# Altium project FLYBACK 220-24V.PrjPcb
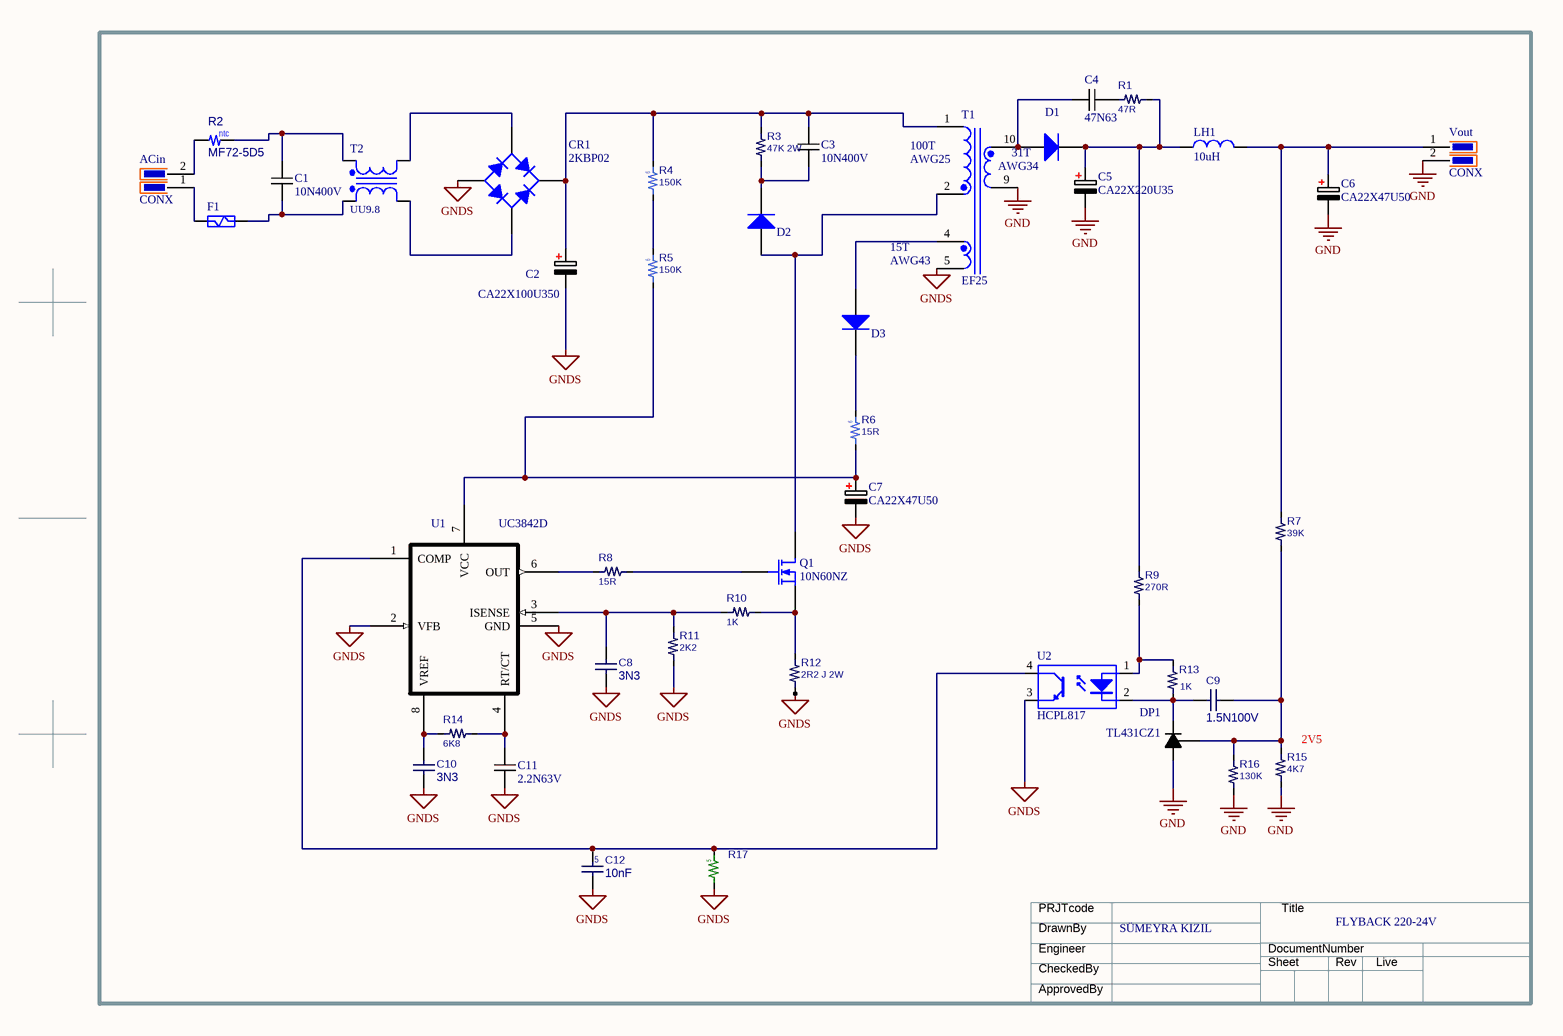
[diagram p0: FLYBACK 220-24V.SchDoc]
1 sheet, 43 parts. Net scope: global (net labels, ports and power ports of the same name join across sheets).
Board file: FLYBACK 220-24V.PcbDoc

## Sheet FLYBACK 220-24V.SchDoc
size A4; SheetNumber: 1; SheetTotal: 1

### Parts
ACin  CONX  [MBDK122]
C1  value 10N400V  [RAD0.3]  (hidden comment: CM03Y10N0V400)
C2  CA22X100U350  [24X30]
C3  value 10N400V  [RAD0.2]  (hidden comment: CM02Y10N0V400)
C4  value 47N63  [RAD0.2]  (hidden comment: CM02Y47N0V63)
C5  CA22X220U35  [8X12XP150]
C6  CA22X47U50  [8X12XP150]
C7  CA22X47U50  [6.3X11]
C8  value 3N3  [RAD0.2]  (hidden comment: CB02X3N30)
C9  value 1.5N100V  [RAD0.2]  (hidden comment: CB02X1N50)
C10  value 3N3  [RAD0.2]  (hidden comment: CB02X3N30)
C11  value 2.2N63V  [RAD0.2]  (hidden comment: CM02Y2N20V63)
C12  value 10nF  [RAD0.3]  (hidden comment: CHC0805-10N0)
CR1  2KBP02  [KBU]
D1  UF5402  [DO-41]  (value not drawn)
D2  UF4007  [DO-41]  (value not drawn)
D3  UF4007  [DO-41]  (value not drawn)
DP1  TL431CZ1  [TL431]
F1  (no value)  [Sigorta Tutucu]
LH1  10uH  [10X13L]
Q1  10N60NZ  [TO220]
R1  value 47R  [AXIAL0.4]  (hidden comment: RF24-47R0)
R2  MF72-5D5  [RAD0.3NTC]
R3  value 47K 2W  [AXIAL0.7]  (hidden comment: RF13-47K0)
R4  value 150K  [AXIAL0.4]  (hidden comment: CHR1206-15R0)
R5  value 150K  [AXIAL0.4]  (hidden comment: CHR1206-15R0)
R6  value 15R  [AXIAL0.5]  (hidden comment: CHR1206-15R0)
R7  value 39K  [AXIAL0.5]  (hidden comment: RF24-39K0)
R8  value 15R  [AXIAL0.4]  (hidden comment: RF24-15R0)
R9  value 270R  [AXIAL0.6]  (hidden comment: RF24-270R)
R10  value 1K  [AXIAL0.4]  (hidden comment: RF24-1K00)
R11  value 2K2  [AXIAL0.4]  (hidden comment: RF24-2K20)
R12  value 2R2 J 2W  [AXIAL0.7]  (hidden comment: RW02J-2R20)
R13  value 1K  [AXIAL0.4]  (hidden comment: RF24-1K00)
R14  value 6K8  [AXIAL0.4]  (hidden comment: RF24-6K80)
R15  value 4K7  [AXIAL0.4]  (hidden comment: RF24-4K70)
R16  value 130K  [AXIAL0.4]  (hidden comment: RF24-130K)
R17  CHR0805-10K0  [AXIAL0.4]  (value not drawn)
T1  EF25  [TRF_EF25_40]
T2  UU9.8  [LFILT11]
U1  UC3842D  [DIP8]
U2  HCPL817  [DIP4]
Vout  CONX  [MBDK122]

### Nets
GND: C5.2 C6.2 DP1.2(A) R15.1 R16.1 T1.9(Sec-) Vout.2
GNDS: C2.2 C7.2 C8.1 C10.1 C11.1 C12.1 CR1.4(A) R11.1 R12.1 R17.1 T1.5(FB-) U1.2(VFB) U1.5(GND) U2.3(E)
NetACin_1: ACin.1 F1.1
NetACin_2: ACin.2 R2.1
NetC1_1: C1.1 F1.2 T2.1
NetC1_2: C1.2 R2.2 T2.2
NetC2_1: C2.1 C3.2 CR1.1(K) R3.2 R4.2 T1.1(Pri+)
NetC3_1: C3.1 D2.2(K) R3.1
NetC4_1: C4.1 D1.1(A) T1.10(Sec+)
NetC4_2: C4.2 R1.1
NetC5_1: C5.1 D1.2(K) LH1.1 R1.2 R9.2
NetC6_1: C6.1 LH1.2 R7.2 Vout.1
NetC7_1: C7.1 R5.1 R6.1 U1.7(VCC)
NetC8_2: C8.2 R10.1 R11.2 U1.3(ISENSE)
NetC9_1: C9.1 DP1.1(K) R13.1 U2.2(K)
NetC9_2: C9.2 DP1.3(REF) R7.1 R15.2 R16.2
NetC10_2: C10.2 R14.1 U1.8(VREF)
NetC11_2: C11.2 R14.2 U1.4(RT/CT)
NetC12_2: C12.2 R17.2 U1.1(COMP) U2.4(C)
NetCR1_2: CR1.2(C) T2.4
NetCR1_3: CR1.3(C) T2.3
NetD2_1: D2.1(A) Q1.2(D) T1.2(Pri-)
NetD3_1: D3.1(A) T1.4(FB+)
NetD3_2: D3.2(K) R6.2
NetQ1_1: Q1.1(G) R8.2
NetQ1_3: Q1.3(S) R10.2 R12.2
NetR4_1: R4.1 R5.2
NetR8_1: R8.1 U1.6(OUT)
NetR9_1: R9.1 R13.2 U2.1(A)

### Notes on the sheet
- (near T1) 100T
- (near T1) AWG25
- (near T1) AWG34
- 31T
- 15T
- AWG43
- (near R15) 2V5
- FLYBACK 220-24V
- SÜMEYRA KIZIL
- PRJTcode
- Title
- DrawnBy
- CheckedBy
- Engineer
- DocumentNumber
- Sheet
- Rev
- Live
- ApprovedBy
- (in symbol CHC0805-10N0) 5
- (in symbol CHR0805-10K0) 5
- (in symbol CHR1206-15R0) 6
- (in symbol MF72-5D5) ntc

### Library data of the parts
ACin Vout = CON2X: X PIN CONN
C1 = CM03Y10N0V400: METALLISED POLYSTER CAP; Manufacturer: Generic Components; Class: Passive; Published: 08/06/2000; Publisher: NET; SubClass: METALLISED POLYSTER CAP
C2 = CA22X68U350: Electrolytic Capacitor general use; Manufacturer: Generic Components; Class: Passive; Value: 68U350; SubClass: Capacitor
C3 = CM02Y10N0V400: METALLISED POLYSTER CAP; Manufacturer: Generic Components; Class: Passive; Published: 08/06/2000; Publisher: NET; SubClass: METALLISED POLYSTER CAP
C4 = CM02Y47N0V63: METALLISED POLYSTER CAP; Manufacturer: Generic Components; Class: Passive; Published: 08/06/2000; Publisher: NET; SubClass: METALLISED POLYSTER CAP
C5 = CA22X220U35: Electrolytic Capacitor general use; Manufacturer: Generic Components; Class: Passive; Value: 220U35; SubClass: Capacitor
C6 C7 = CA22X47U50: Electrolytic Capacitor general use; Manufacturer: Generic Components; Class: Passive; Value: 47U50; SubClass: Capacitor
C8 C10 = CB02X3N30: CERAMIC DISC CAPACITOR; Manufacturer: Generic Components; Class: Passive; Published: 12/03/04; Publisher: Nettas Technology Center; SubClass: Capacitor
C9 = CB02X1N50: CERAMIC DISC CAPACITOR; Manufacturer: Generic Components; Class: Passive; Published: 12/03/04; Publisher: Nettas Technology Center; SubClass: Capacitor
C11 = CM02Y2N20V63: METALLISED POLYSTER CAP; Manufacturer: Generic Components; Class: Passive; Published: 08/06/2000; Publisher: NET; SubClass: METALLISED POLYSTER CAP
C12 = CHC0805-10N0: TH Capacitor; Manufacturer: Generic Components; Class: Passive; Published: 22/12/2003; Publisher: Nettas Technology Center; SubClass: Capacitor
CR1 = 2KBP02: 2 Amp Single Phase Rectifier Bridge; Manufacturer: International Rectifier; Class: Discrete; SubClass: Rectifier - Bridge; Published: 8/06/2000; Publisher: Altium Hobart Technology Centre
D1 = UF5402: General Purpose ULTRA FAST Rectifiers; Manufacturer: Generic Components; Class: Discrete; Published: 08/06/2000; Publisher: Altium Hobart Technology Centre
D2 D3 = UF4007: General Purpose ULTRA FAST Rectifiers; Manufacturer: Generic Components; Class: Discrete; Published: 08/06/2000; Publisher: Altium Hobart Technology Centre
DP1 = TL431CZ1: Programmable Voltage Reference; Manufacturer: ST-Microelectronics; Class: Power Management; Published: 24/08/2001; Publisher: Altium Hobart Technology Centre; SubClass: Voltage Reference
F1 = FUSE-GL600: Fuse; Manufacturer: Generic Components; Class: Passive; Published: 08/06/2000; Publisher: Altium Hobart Technology Centre; SubClass: Fuse
LH1 = Inductor: LH 10uH; Manufacturer: Generic Components; Class: Passive; Value: 2mH; Published: 08/06/2000; Publisher: Altium Hobart Technology Centre; SubClass: Inductor
Q1 = 10N60NZ: FULLY AUTOPROTECTED POWER MOSFET; Manufacturer: Generic Components; Class: Discrete; SubClass: MOSFET - Low Power; Published: 08/06/2000; Publisher: Altium Hobart Technology Centre
R1 = RF24-47R0: AXIAL Resistor 0.4; Manufacturer: Generic Components; Class: Passive; Published: 22/12/2003; Publisher: Nettas Technology Center; SubClass: Resistor
R2 = MF72-5D5: Power NTC Thermistor; Manufacturer: Generic Components; Class: Passive; SubClass: Resistor; Published: 22/12/2003; Publisher: Nettas Technology Center; Value: MF72-5D5
R3 = RF13-47K0: AXIAL Resistor 0.7; Manufacturer: Generic Components; Class: Passive; Published: 22/12/2003; Publisher: Nettas Technology Center; SubClass: Resistor
R4-R6 = CHR1206-15R0: SMD Resistor; Manufacturer: Generic Components; Class: Passive; Published: 22/12/2003; Publisher: Nettas Technology Center; SubClass: Resistor
R7 = RF24-39K0: AXIAL Resistor; Manufacturer: Generic Components; Class: Passive; Published: 22/12/2003; Publisher: Nettas Technology Center; SubClass: Resistor
R8 = RF24-15R0: AXIAL Resistor; Manufacturer: Generic Components; Class: Passive; Published: 22/12/2003; Publisher: Nettas Technology Center; SubClass: Resistor
R9 = RF24-270R: AXIAL Resistor; Manufacturer: Generic Components; Class: Passive; Published: 22/12/2003; Publisher: Nettas Technology Center; SubClass: Resistor
R10 R13 = RF24-1K00: AXIAL Resistor; Manufacturer: Generic Components; Class: Passive; Published: 22/12/2003; Publisher: Nettas Technology Center; SubClass: Resistor
R11 = RF24-2K20: AXIAL Resistor; Manufacturer: Generic Components; Class: Passive; Published: 22/12/2003; Publisher: Nettas Technology Center; SubClass: Resistor
R12 = RW02J-2R20: AXIAL WIRE Resistor; Manufacturer: Generic Components; Class: Passive; Published: 22/12/2003; Publisher: Nettas Technology Center; SubClass: Resistor
R14 = RF24-6K80: AXIAL Resistor; Manufacturer: Generic Components; Class: Passive; Published: 22/12/2003; Publisher: Nettas Technology Center; SubClass: Resistor
R15 = RF24-4K70: AXIAL Resistor; Manufacturer: Generic Components; Class: Passive; Published: 22/12/2003; Publisher: Nettas Technology Center; SubClass: Resistor
R16 = RF24-130K: AXIAL Resistor; Manufacturer: Generic Components; Class: Passive; Published: 22/12/2003; Publisher: Nettas Technology Center; SubClass: Resistor
R17 = CHR0805-10K0: TH Resistor; Manufacturer: Generic Components; Class: Passive; Published: 22/12/2003; Publisher: Nettas Technology Center; SubClass: Resistor
T1 = TRF_EF25_40: Manufacturer: Generic Components; Class: Passive; SubClass: Transformer; Published: 08/06/2000; Publisher: Altium Hobart Technology Centre
T2 = LINEFILTER12: LINEFILTER CUPL TRF
U1 = UC3844D1: SMPS Controller
U2 = HCPL817: High Density Mounting Type Photocoupler; Class: Optoelectronic; Published: 2004; Manufacturer: www.cosmo-ic.com